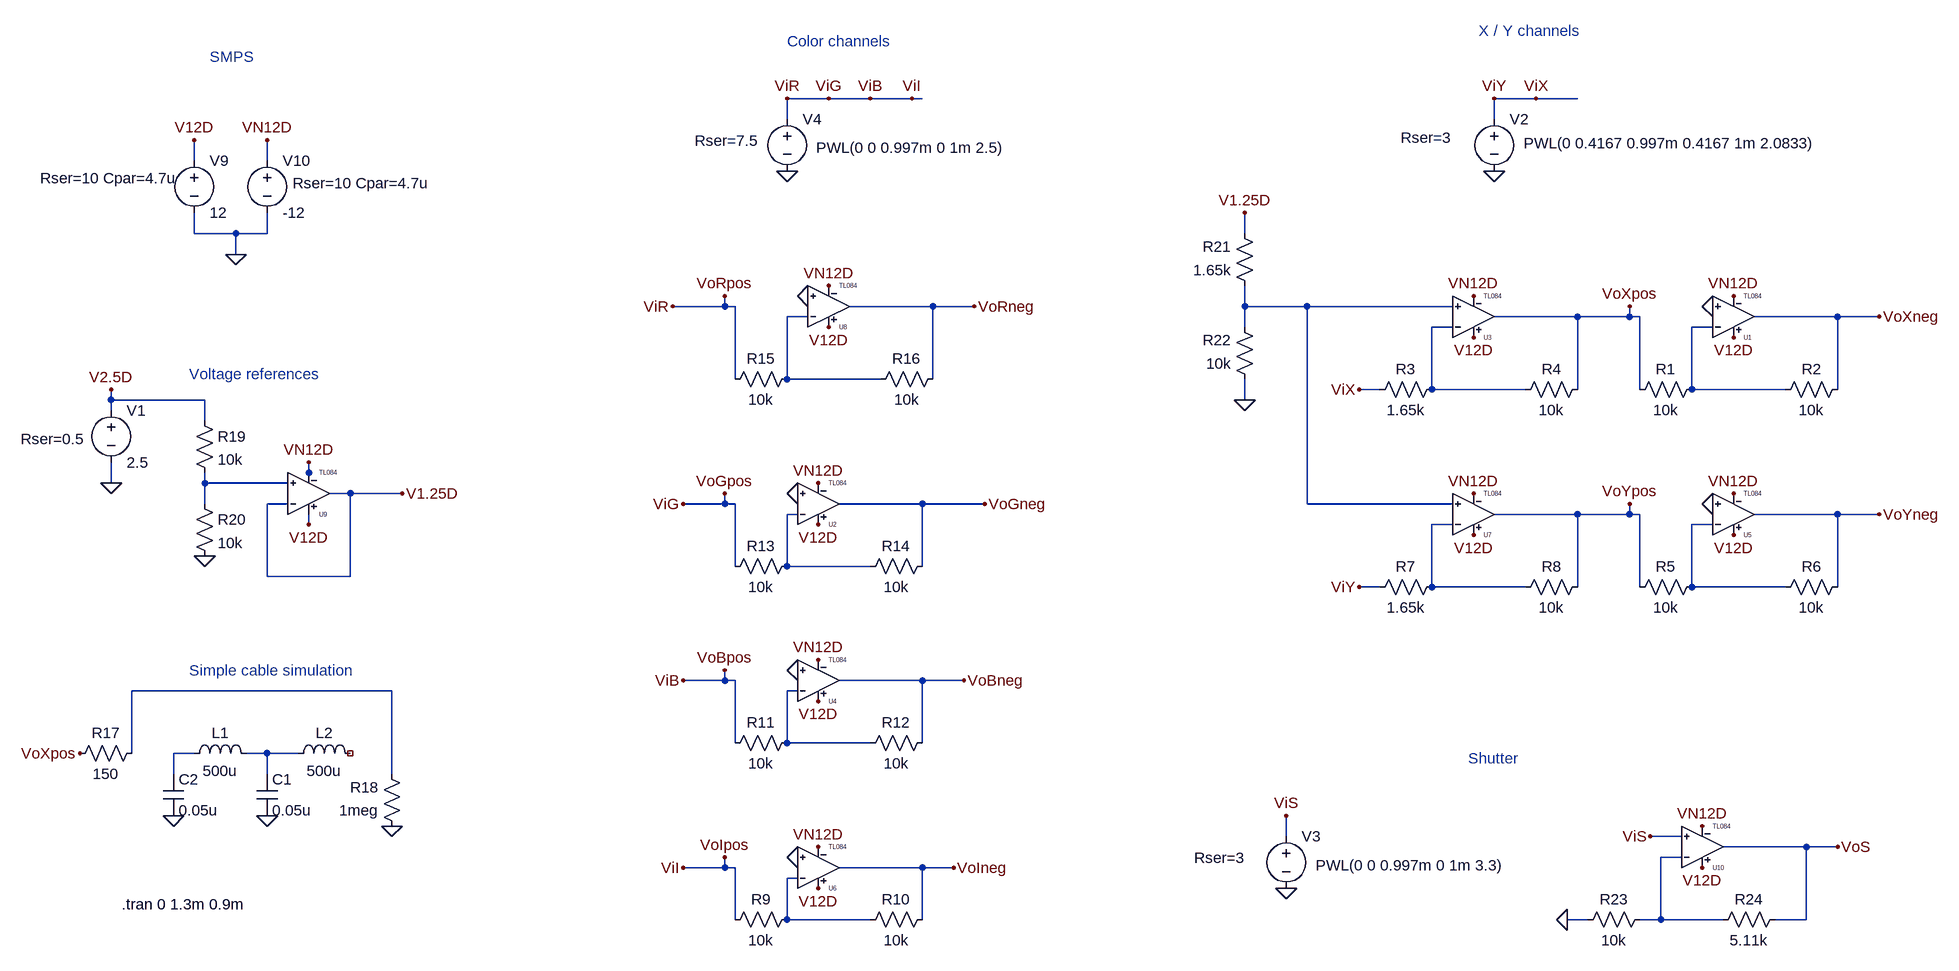
[diagram p0: schematic correctionamps.asc]
correctionamps.asc, the LTspice schematic file:
Version 4
SHEET 1 2184 1012
WIRE 416 -464 352 -464
WIRE 480 -464 416 -464
WIRE 544 -464 480 -464
WIRE 560 -464 544 -464
WIRE 1504 -464 1440 -464
WIRE 1568 -464 1504 -464
WIRE 352 -432 352 -464
WIRE 1440 -432 1440 -464
WIRE -560 -368 -560 -400
WIRE -448 -368 -448 -400
WIRE -560 -256 -560 -288
WIRE -496 -256 -560 -256
WIRE -448 -256 -448 -288
WIRE -448 -256 -496 -256
WIRE 1056 -256 1056 -288
WIRE -496 -224 -496 -256
WIRE 256 -144 256 -160
WIRE 256 -144 176 -144
WIRE 272 -144 256 -144
WIRE 576 -144 448 -144
WIRE 640 -144 576 -144
WIRE 1056 -144 1056 -176
WIRE 1152 -144 1056 -144
WIRE 1376 -144 1152 -144
WIRE 384 -128 352 -128
WIRE 1568 -128 1440 -128
WIRE 1648 -128 1648 -144
WIRE 1648 -128 1568 -128
WIRE 1664 -128 1648 -128
WIRE 1968 -128 1840 -128
WIRE 2032 -128 1968 -128
WIRE 1056 -112 1056 -144
WIRE 1376 -112 1344 -112
WIRE 1776 -112 1744 -112
WIRE 272 -32 272 -144
WIRE 352 -32 352 -128
WIRE 496 -32 352 -32
WIRE 576 -32 576 -144
WIRE 1264 -16 1232 -16
WIRE 1344 -16 1344 -112
WIRE 1488 -16 1344 -16
WIRE 1568 -16 1568 -128
WIRE 1664 -16 1664 -128
WIRE 1744 -16 1744 -112
WIRE 1888 -16 1744 -16
WIRE 1968 -16 1968 -128
WIRE -688 0 -688 -16
WIRE -544 0 -688 0
WIRE 1056 0 1056 -32
WIRE -688 16 -688 0
WIRE -544 32 -544 0
WIRE -384 112 -384 96
WIRE -688 128 -688 96
WIRE -544 128 -544 112
WIRE -416 128 -544 128
WIRE -384 128 -384 112
WIRE -320 144 -352 144
WIRE -240 144 -320 144
WIRE -544 160 -544 128
WIRE -416 160 -448 160
WIRE 256 160 256 144
WIRE 256 160 192 160
WIRE 272 160 256 160
WIRE 560 160 432 160
WIRE 656 160 560 160
WIRE 1152 160 1152 -144
WIRE 1376 160 1152 160
WIRE 368 176 352 176
WIRE 1568 176 1440 176
WIRE 1648 176 1648 160
WIRE 1648 176 1568 176
WIRE 1664 176 1648 176
WIRE 1968 176 1840 176
WIRE 2032 176 1968 176
WIRE -384 192 -384 176
WIRE 1376 192 1344 192
WIRE 1776 192 1744 192
WIRE 272 256 272 160
WIRE 352 256 352 176
WIRE 480 256 352 256
WIRE 560 256 560 160
WIRE -448 272 -448 160
WIRE -320 272 -320 144
WIRE -320 272 -448 272
WIRE 1264 288 1232 288
WIRE 1344 288 1344 192
WIRE 1488 288 1344 288
WIRE 1568 288 1568 176
WIRE 1664 288 1664 176
WIRE 1744 288 1744 192
WIRE 1888 288 1744 288
WIRE 1968 288 1968 176
WIRE 256 432 256 416
WIRE 256 432 192 432
WIRE 272 432 256 432
WIRE 560 432 432 432
WIRE 624 432 560 432
WIRE -256 448 -656 448
WIRE 368 448 352 448
WIRE 272 528 272 432
WIRE 352 528 352 448
WIRE 480 528 352 528
WIRE 560 528 560 432
WIRE -656 544 -656 448
WIRE -560 544 -592 544
WIRE -448 544 -480 544
WIRE -400 544 -448 544
WIRE -592 576 -592 544
WIRE -448 576 -448 544
WIRE -256 576 -256 448
WIRE 1120 672 1120 640
WIRE 1728 672 1680 672
WIRE 1920 688 1792 688
WIRE 1968 688 1920 688
WIRE 1728 704 1696 704
WIRE 256 720 256 704
WIRE 256 720 192 720
WIRE 272 720 256 720
WIRE 560 720 432 720
WIRE 608 720 560 720
WIRE 368 736 352 736
WIRE 272 800 272 720
WIRE 352 800 352 736
WIRE 480 800 352 800
WIRE 560 800 560 720
WIRE 1584 800 1552 800
WIRE 1696 800 1696 704
WIRE 1696 800 1664 800
WIRE 1792 800 1696 800
WIRE 1920 800 1920 688
WIRE 1920 800 1872 800
FLAG -688 128 0
FLAG -496 -224 0
FLAG -560 -400 V12D
FLAG -448 -400 VN12D
FLAG -688 -16 V2.5D
FLAG 416 -176 VN12D
FLAG 400 128 VN12D
FLAG 400 400 VN12D
FLAG 400 688 VN12D
FLAG 416 -112 V12D
FLAG 400 192 V12D
FLAG 400 464 V12D
FLAG 400 752 V12D
FLAG 384 -160 0
FLAG 368 144 0
FLAG 368 416 0
FLAG 368 704 0
FLAG 256 -160 VoRpos
FLAG 256 144 VoGpos
FLAG 256 416 VoBpos
FLAG 256 704 VoIpos
FLAG 192 432 ViB
FLAG 192 160 ViG
FLAG 176 -144 ViR
FLAG 192 720 ViI
FLAG 624 432 VoBneg
FLAG 656 160 VoGneg
FLAG 640 -144 VoRneg
FLAG 608 720 VoIneg
FLAG 352 -352 0
FLAG 352 -464 ViR
FLAG -384 96 VN12D
FLAG -384 192 V12D
FLAG -240 144 V1.25D
FLAG -544 240 0
FLAG -592 640 0
FLAG -448 640 0
FLAG -256 656 0
FLAG -736 544 VoXpos
FLAG 416 -464 ViG
FLAG 480 -464 ViB
FLAG 544 -464 ViI
FLAG 1440 -352 0
FLAG 1440 -464 ViY
FLAG 1504 -464 ViX
FLAG 1808 -160 VN12D
FLAG 1808 -96 V12D
FLAG 1776 -144 0
FLAG 1648 -144 VoXpos
FLAG 2032 -128 VoXneg
FLAG 1408 -160 VN12D
FLAG 1408 -96 V12D
FLAG 1232 -16 ViX
FLAG 1808 144 VN12D
FLAG 1808 208 V12D
FLAG 1776 160 0
FLAG 1648 160 VoYpos
FLAG 2032 176 VoYneg
FLAG 1408 144 VN12D
FLAG 1408 208 V12D
FLAG 1232 288 ViY
FLAG 1056 -288 V1.25D
FLAG 1056 0 0
FLAG 1760 656 VN12D
FLAG 1760 720 V12D
FLAG 1968 688 VoS
FLAG 1120 752 0
FLAG 1120 640 ViS
FLAG 1680 672 ViS
FLAG 1552 800 0
SYMBOL voltage -688 0 R0
WINDOW 123 0 0 Left 2
WINDOW 39 -139 60 Left 2
SYMATTR SpiceLine Rser=0.5
SYMATTR InstName V1
SYMATTR Value 2.5
SYMBOL voltage 352 -448 R0
WINDOW 123 24 124 Left 2
WINDOW 39 -142 49 Left 2
WINDOW 3 45 60 Left 2
SYMATTR SpiceLine Rser=7.5
SYMATTR Value PWL(0 0 0.997m 0 1m 2.5)
SYMATTR InstName V4
SYMBOL Opamps\\tl084 400 224 M180
SYMATTR InstName U2
SYMBOL Opamps\\tl084 400 496 M180
SYMATTR InstName U4
SYMBOL Opamps\\tl084 400 784 M180
SYMATTR InstName U6
SYMBOL Opamps\\tl084 416 -80 M180
SYMATTR InstName U8
SYMBOL voltage -560 -384 R0
WINDOW 123 0 0 Left 2
WINDOW 39 -237 43 Left 2
SYMATTR SpiceLine Rser=10 Cpar=4.7u
SYMATTR InstName V9
SYMATTR Value 12
SYMBOL voltage -448 -384 R0
WINDOW 123 0 0 Left 2
WINDOW 39 39 50 Left 2
SYMATTR SpiceLine Rser=10 Cpar=4.7u
SYMATTR InstName V10
SYMATTR Value -12
SYMBOL res 368 784 R90
WINDOW 0 0 56 VBottom 2
WINDOW 3 32 56 VTop 2
SYMATTR InstName R9
SYMATTR Value 10k
SYMATTR SpiceLine tol=1
SYMBOL res 576 784 R90
WINDOW 0 0 56 VBottom 2
WINDOW 3 32 56 VTop 2
SYMATTR InstName R10
SYMATTR Value 10k
SYMATTR SpiceLine tol=1
SYMBOL res 368 512 R90
WINDOW 0 0 56 VBottom 2
WINDOW 3 32 56 VTop 2
SYMATTR InstName R11
SYMATTR Value 10k
SYMATTR SpiceLine tol=1
SYMBOL res 576 512 R90
WINDOW 0 0 56 VBottom 2
WINDOW 3 32 56 VTop 2
SYMATTR InstName R12
SYMATTR Value 10k
SYMATTR SpiceLine tol=1
SYMBOL res 368 240 R90
WINDOW 0 0 56 VBottom 2
WINDOW 3 32 56 VTop 2
SYMATTR InstName R13
SYMATTR Value 10k
SYMATTR SpiceLine tol=1
SYMBOL res 576 240 R90
WINDOW 0 0 56 VBottom 2
WINDOW 3 32 56 VTop 2
SYMATTR InstName R14
SYMATTR Value 10k
SYMATTR SpiceLine tol=1
SYMBOL res 368 -48 R90
WINDOW 0 0 56 VBottom 2
WINDOW 3 32 56 VTop 2
SYMATTR InstName R15
SYMATTR Value 10k
SYMATTR SpiceLine tol=1
SYMBOL res 592 -48 R90
WINDOW 0 0 56 VBottom 2
WINDOW 3 32 56 VTop 2
SYMATTR InstName R16
SYMATTR Value 10k
SYMATTR SpiceLine tol=1
SYMBOL Opamps\\tl084 -384 208 M180
SYMATTR InstName U9
SYMBOL res -560 16 R0
SYMATTR InstName R19
SYMATTR Value 10k
SYMATTR SpiceLine tol=1
SYMBOL res -560 144 R0
SYMATTR InstName R20
SYMATTR Value 10k
SYMATTR SpiceLine tol=1
SYMBOL cap -464 576 R0
SYMATTR InstName C1
SYMATTR Value 0.05u
SYMBOL cap -608 576 R0
SYMATTR InstName C2
SYMATTR Value 0.05u
SYMBOL res -640 528 R90
WINDOW 0 0 56 VBottom 2
WINDOW 3 32 56 VTop 2
SYMATTR InstName R17
SYMATTR Value 150
SYMATTR SpiceLine tol=1
SYMBOL ind -576 560 R270
WINDOW 0 32 56 VTop 2
WINDOW 3 5 56 VBottom 2
SYMATTR InstName L1
SYMATTR Value 500u
SYMATTR SpiceLine Rser=100
SYMBOL ind -416 560 R270
WINDOW 0 32 56 VTop 2
WINDOW 3 5 56 VBottom 2
SYMATTR InstName L2
SYMATTR Value 500u
SYMATTR SpiceLine Rser=100
SYMBOL res -240 672 R180
WINDOW 0 36 76 Left 2
WINDOW 3 36 40 Left 2
SYMATTR InstName R18
SYMATTR Value 1meg
SYMATTR SpiceLine tol=1
SYMBOL voltage 1440 -448 R0
WINDOW 123 24 124 Left 2
WINDOW 39 -144 44 Left 2
WINDOW 3 45 53 Left 2
SYMATTR SpiceLine Rser=3
SYMATTR Value PWL(0 0.4167 0.997m 0.4167 1m 2.0833)
SYMATTR InstName V2
SYMBOL Opamps\\tl084 1808 -64 M180
SYMATTR InstName U1
SYMBOL res 1760 -32 R90
WINDOW 0 0 56 VBottom 2
WINDOW 3 32 56 VTop 2
SYMATTR InstName R1
SYMATTR Value 10k
SYMATTR SpiceLine tol=1
SYMBOL res 1984 -32 R90
WINDOW 0 0 56 VBottom 2
WINDOW 3 32 56 VTop 2
SYMATTR InstName R2
SYMATTR Value 10k
SYMATTR SpiceLine tol=1
SYMBOL Opamps\\tl084 1408 -64 M180
SYMATTR InstName U3
SYMBOL res 1360 -32 R90
WINDOW 0 0 56 VBottom 2
WINDOW 3 32 56 VTop 2
SYMATTR InstName R3
SYMATTR Value 1.65k
SYMATTR SpiceLine tol=1
SYMBOL res 1584 -32 R90
WINDOW 0 0 56 VBottom 2
WINDOW 3 32 56 VTop 2
SYMATTR InstName R4
SYMATTR Value 10k
SYMATTR SpiceLine tol=1
SYMBOL Opamps\\tl084 1808 240 M180
SYMATTR InstName U5
SYMBOL res 1760 272 R90
WINDOW 0 0 56 VBottom 2
WINDOW 3 32 56 VTop 2
SYMATTR InstName R5
SYMATTR Value 10k
SYMATTR SpiceLine tol=1
SYMBOL res 1984 272 R90
WINDOW 0 0 56 VBottom 2
WINDOW 3 32 56 VTop 2
SYMATTR InstName R6
SYMATTR Value 10k
SYMATTR SpiceLine tol=1
SYMBOL Opamps\\tl084 1408 240 M180
SYMATTR InstName U7
SYMBOL res 1360 272 R90
WINDOW 0 0 56 VBottom 2
WINDOW 3 32 56 VTop 2
SYMATTR InstName R7
SYMATTR Value 1.65k
SYMATTR SpiceLine tol=1
SYMBOL res 1584 272 R90
WINDOW 0 0 56 VBottom 2
WINDOW 3 32 56 VTop 2
SYMATTR InstName R8
SYMATTR Value 10k
SYMATTR SpiceLine tol=1
SYMBOL res 1072 -160 R180
WINDOW 0 36 76 Left 2
WINDOW 3 36 40 Left 2
SYMATTR InstName R21
SYMATTR Value 1.65k
SYMATTR SpiceLine tol=1
SYMBOL res 1072 -16 R180
WINDOW 0 36 76 Left 2
WINDOW 3 36 40 Left 2
SYMATTR InstName R22
SYMATTR Value 10k
SYMATTR SpiceLine tol=1
SYMBOL Opamps\\tl084 1760 752 M180
SYMATTR InstName U10
SYMBOL res 1680 784 R90
WINDOW 0 0 56 VBottom 2
WINDOW 3 32 56 VTop 2
SYMATTR InstName R23
SYMATTR Value 10k
SYMATTR SpiceLine tol=1
SYMBOL res 1888 784 R90
WINDOW 0 0 56 VBottom 2
WINDOW 3 32 56 VTop 2
SYMATTR InstName R24
SYMATTR Value 5.11k
SYMATTR SpiceLine tol=1
SYMBOL voltage 1120 656 R0
WINDOW 123 24 124 Left 2
WINDOW 39 -142 49 Left 2
WINDOW 3 45 60 Left 2
SYMATTR SpiceLine Rser=3
SYMATTR Value PWL(0 0 0.997m 0 1m 3.3)
SYMATTR InstName V3
TEXT -672 776 Left 2 !.tran 0 1.3m 0.9m
TEXT -568 416 Left 2 ;Simple cable simulation
TEXT -568 -40 Left 2 ;Voltage references
TEXT -536 -528 Left 2 ;SMPS
TEXT 352 -552 Left 2 ;Color channels
TEXT 1416 -568 Left 2 ;X / Y channels
TEXT 1400 552 Left 2 ;Shutter

The netlist it stands for:
* correctionamps.asc
V1 V2.5D 0 2.5 Rser=0.5
V4 ViI 0 PWL(0 0 0.997m 0 1m 2.5) Rser=7.5
XU2 0 N006 V12D VN12D VoGneg TL084  ; pins In+ In- V+ V- OUT
XU4 0 N010 V12D VN12D VoBneg TL084  ; pins In+ In- V+ V- OUT
XU6 0 N014 V12D VN12D VoIneg TL084  ; pins In+ In- V+ V- OUT
XU8 0 N002 V12D VN12D VoRneg TL084  ; pins In+ In- V+ V- OUT
V9 V12D 0 12 Rser=10 Cpar=4.7u
V10 VN12D 0 -12 Rser=10 Cpar=4.7u
R9 N014 ViI 10k tol=1
R10 VoIneg N014 10k tol=1
R11 N010 ViI 10k tol=1
R12 VoBneg N010 10k tol=1
R13 N006 ViI 10k tol=1
R14 VoGneg N006 10k tol=1
R15 N002 ViI 10k tol=1
R16 VoRneg N002 10k tol=1
XU9 N005 V1.25D V12D VN12D V1.25D TL084  ; pins In+ In- V+ V- OUT
R19 V2.5D N005 10k tol=1
R20 N005 0 10k tol=1
C1 N012 0 0.05u
C2 N011 0 0.05u
R17 N009 VoXpos 150 tol=1
L1 N011 N012 500u Rser=100
L2 N012 NC_01 500u Rser=100
R18 0 N009 1meg tol=1
V2 ViX 0 PWL(0 0.4167 0.997m 0.4167 1m 2.0833) Rser=3
XU1 0 N004 V12D VN12D VoXneg TL084  ; pins In+ In- V+ V- OUT
R1 N004 VoXpos 10k tol=1
R2 VoXneg N004 10k tol=1
XU3 N001 N003 V12D VN12D VoXpos TL084  ; pins In+ In- V+ V- OUT
R3 N003 ViX 1.65k tol=1
R4 VoXpos N003 10k tol=1
XU5 0 N008 V12D VN12D VoYneg TL084  ; pins In+ In- V+ V- OUT
R5 N008 VoYpos 10k tol=1
R6 VoYneg N008 10k tol=1
XU7 N001 N007 V12D VN12D VoYpos TL084  ; pins In+ In- V+ V- OUT
R7 N007 ViX 1.65k tol=1
R8 VoYpos N007 10k tol=1
R21 N001 V1.25D 1.65k tol=1
R22 0 N001 10k tol=1
XU10 ViS N013 V12D VN12D VoS TL084  ; pins In+ In- V+ V- OUT
R23 N013 0 10k tol=1
R24 VoS N013 5.11k tol=1
V3 ViS 0 PWL(0 0 0.997m 0 1m 3.3) Rser=3
.tran 0 1.3m 0.9m
* Simple cable simulation
* Voltage references
* SMPS
* Color channels
* X / Y channels
* Shutter
.lib TL084.lib
.backanno
.end